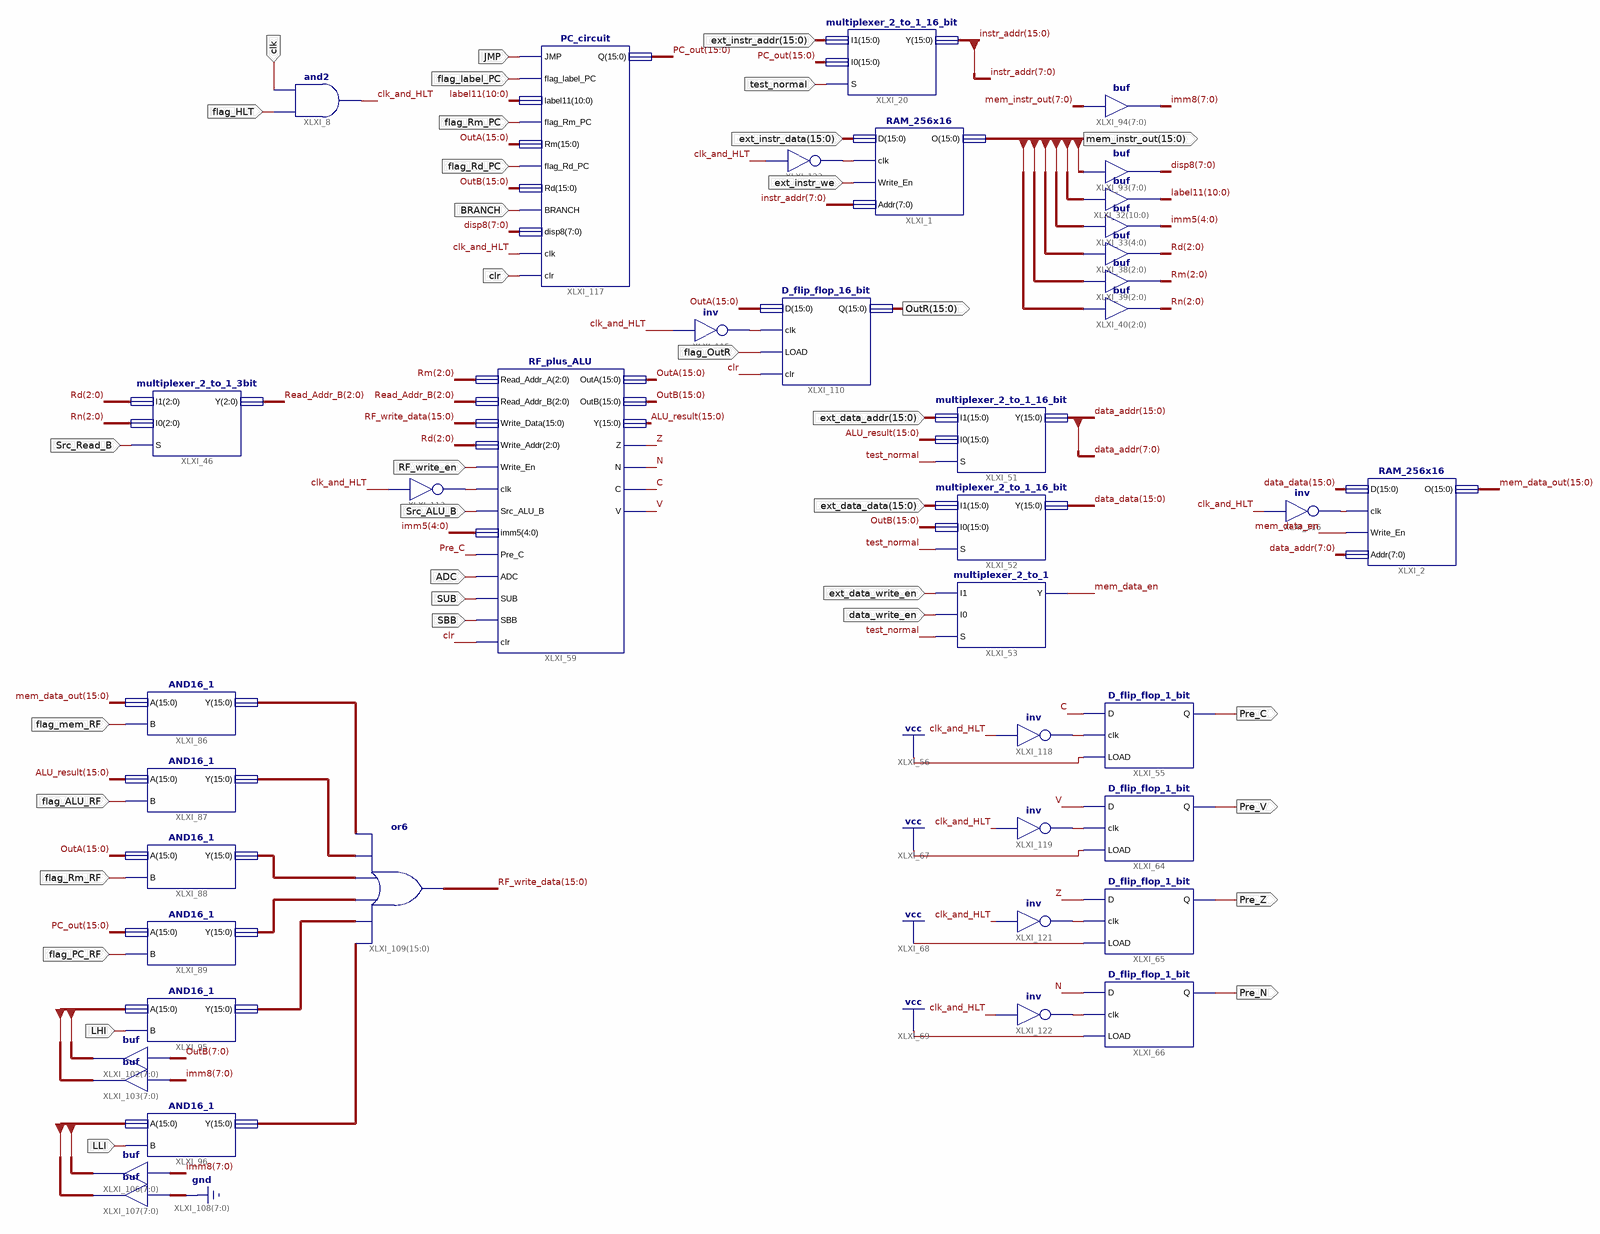
[diagram p0: schematic sheet 1]
// Xilinx ISE schematic Datapath_Module.sch (virtex6) as structural Verilog: 41 symbols, 35 ports
module Datapath_Module (
  input  clk,
  input  flag_HLT,
  input  test_normal,
  input  ext_instr_we,
  input  [15:0] ext_instr_data,
  input  clr,
  input  Src_Read_B,
  input  ADC,
  input  SUB,
  input  SBB,
  input  JMP,
  input  flag_label_PC,
  input  flag_Rm_PC,
  input  flag_Rd_PC,
  input  BRANCH,
  input  Src_ALU_B,
  input  [15:0] ext_instr_addr,
  input  [15:0] ext_data_addr,
  input  [15:0] ext_data_data,
  input  ext_data_write_en,
  input  data_write_en,
  input  flag_mem_RF,
  input  flag_ALU_RF,
  input  flag_Rm_RF,
  input  flag_PC_RF,
  input  RF_write_en,
  input  LHI,
  input  LLI,
  input  flag_OutR,
  output [15:0] mem_instr_out,
  output Pre_C,
  output [15:0] OutR,
  output Pre_V,
  output Pre_Z,
  output Pre_N
);

  wire C, clk_and_HLT, mem_data_en, N, V, XLXN_220, XLXN_226, XLXN_227, XLXN_231, XLXN_232, XLXN_233,
       XLXN_234, XLXN_266, Z;
  wire [2:0] Rd, Read_Addr_B, Rm, Rn;
  wire [4:0] imm5;
  wire [7:0] disp8, imm8;
  wire [10:0] label11;
  wire [15:0] ALU_result, data_addr, data_data, instr_addr, LHI_data, LLI_data, mem_data_out, OutA, OutB,
       PC_out, RF_write_data, XLXN_210, XLXN_211, XLXN_214, XLXN_215, XLXN_216, XLXN_217;

  and XLXI_8 (clk_and_HLT, flag_HLT, clk);
  multiplexer_2_to_1_16_bit XLXI_20 (.I0(PC_out), .I1(ext_instr_addr), .S(test_normal), .Y(instr_addr));
  RAM_256x16 XLXI_1 (
    .Addr(instr_addr[7:0]), .clk(XLXN_266), .D(ext_instr_data), .O(mem_instr_out), .Write_En(ext_instr_we));
  assign imm5 = mem_instr_out[4:0];  // buf XLXI_33[4..0], 5 bits wide
  assign label11 = mem_instr_out[10:0];  // buf XLXI_32[10..0], 11 bits wide
  assign Rd = mem_instr_out[10:8];  // buf XLXI_38[2..0], 3 bits wide
  assign Rm = mem_instr_out[7:5];  // buf XLXI_39[2..0], 3 bits wide
  assign Rn = mem_instr_out[4:2];  // buf XLXI_40[2..0], 3 bits wide
  multiplexer_2_to_1_3bit XLXI_46 (.I0(Rn), .I1(Rd), .S(Src_Read_B), .Y(Read_Addr_B));
  multiplexer_2_to_1_16_bit XLXI_51 (.I0(ALU_result), .I1(ext_data_addr), .S(test_normal), .Y(data_addr));
  multiplexer_2_to_1_16_bit XLXI_52 (.I0(OutB), .I1(ext_data_data), .S(test_normal), .Y(data_data));
  multiplexer_2_to_1 XLXI_53 (.I0(data_write_en), .I1(ext_data_write_en), .S(test_normal), .Y(mem_data_en));
  AND16_1 XLXI_86 (.A(mem_data_out), .B(flag_mem_RF), .Y(XLXN_210));
  AND16_1 XLXI_87 (.A(ALU_result), .B(flag_ALU_RF), .Y(XLXN_211));
  AND16_1 XLXI_88 (.A(OutA), .B(flag_Rm_RF), .Y(XLXN_214));
  AND16_1 XLXI_89 (.A(PC_out), .B(flag_PC_RF), .Y(XLXN_215));
  assign disp8 = mem_instr_out[7:0];  // buf XLXI_93[7..0], 8 bits wide
  assign imm8 = mem_instr_out[7:0];  // buf XLXI_94[7..0], 8 bits wide
  AND16_1 XLXI_95 (.A(LHI_data), .B(LHI), .Y(XLXN_216));
  assign LHI_data[7:0] = OutB[7:0];  // buf XLXI_102[7..0], 8 bits wide
  assign LHI_data[15:8] = imm8;  // buf XLXI_103[7..0], 8 bits wide
  AND16_1 XLXI_96 (.A(LLI_data), .B(LLI), .Y(XLXN_217));
  assign LLI_data[7:0] = imm8;  // buf XLXI_106[7..0], 8 bits wide
  assign LLI_data[15:8] = {8{1'b0}};  // buf XLXI_107[7..0], 8 bits wide
  assign RF_write_data = XLXN_217 | XLXN_216 | XLXN_215 | XLXN_214 | XLXN_211 | XLXN_210;  // or6 XLXI_109[15..0], 16 bits wide
  D_flip_flop_16_bit XLXI_110 (.clk(XLXN_226), .clr(clr), .D(OutA), .LOAD(flag_OutR), .Q(OutR));
  RF_plus_ALU XLXI_59 (
    .Read_Addr_A(Rm), .Read_Addr_B(Read_Addr_B), .Pre_C(Pre_C), .Write_Data(RF_write_data), .ADC(ADC),
    .Src_ALU_B(Src_ALU_B), .Write_Addr(Rd), .Write_En(RF_write_en), .SUB(SUB), .clk(XLXN_220), .SBB(SBB),
    .clr(clr), .imm5(imm5), .OutA(OutA), .OutB(OutB), .Y(ALU_result), .Z(Z), .N(N), .C(C), .V(V));
  not XLXI_113 (XLXN_220, clk_and_HLT);
  not XLXI_115 (XLXN_226, clk_and_HLT);
  PC_circuit XLXI_117 (
    .Rd(OutB), .flag_Rd_PC(flag_Rd_PC), .flag_label_PC(flag_label_PC), .label11(label11), .Rm(OutA),
    .flag_Rm_PC(flag_Rm_PC), .disp8(disp8), .JMP(JMP), .BRANCH(BRANCH), .clk(clk_and_HLT), .clr(clr),
    .Q(PC_out));
  not XLXI_116 (XLXN_227, clk_and_HLT);
  RAM_256x16 XLXI_2 (.Addr(data_addr[7:0]), .clk(XLXN_227), .D(data_data), .O(mem_data_out), .Write_En(mem_data_en));
  D_flip_flop_1_bit XLXI_64 (.clk(XLXN_232), .D(V), .LOAD(1'b1), .Q(Pre_V));
  D_flip_flop_1_bit XLXI_65 (.clk(XLXN_233), .D(Z), .LOAD(1'b1), .Q(Pre_Z));
  D_flip_flop_1_bit XLXI_66 (.clk(XLXN_234), .D(N), .LOAD(1'b1), .Q(Pre_N));
  not XLXI_118 (XLXN_231, clk_and_HLT);
  not XLXI_119 (XLXN_232, clk_and_HLT);
  not XLXI_121 (XLXN_233, clk_and_HLT);
  not XLXI_122 (XLXN_234, clk_and_HLT);
  D_flip_flop_1_bit XLXI_55 (.clk(XLXN_231), .D(C), .LOAD(1'b1), .Q(Pre_C));
  not XLXI_123 (XLXN_266, clk_and_HLT);
endmodule
